# Altium schematic sheet Wiring.SchDoc
size A4; SheetNumber: 1; SheetTotal: 1
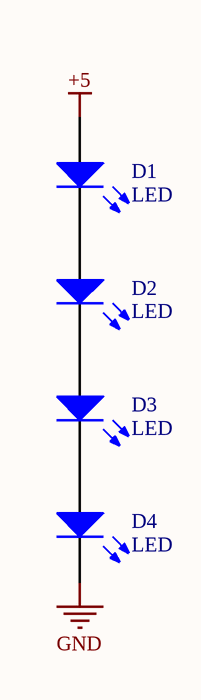
[diagram p0: Wiring.SchDoc]

## Parts
D1  LED  [led]
D2  LED  [led]
D3  LED  [led]
D4  LED  [led]

## Nets
+5: D1.1(A)
GND: D4.2(K)
NetD1_2: D1.2(K) D2.1(A)
NetD2_2: D2.2(K) D3.1(A)
NetD3_2: D3.2(K) D4.1(A)

## Library data of the parts
D1-D4 = LED3